# EAGLE design pololu-steppers-power-side (EAGLE 5.06)
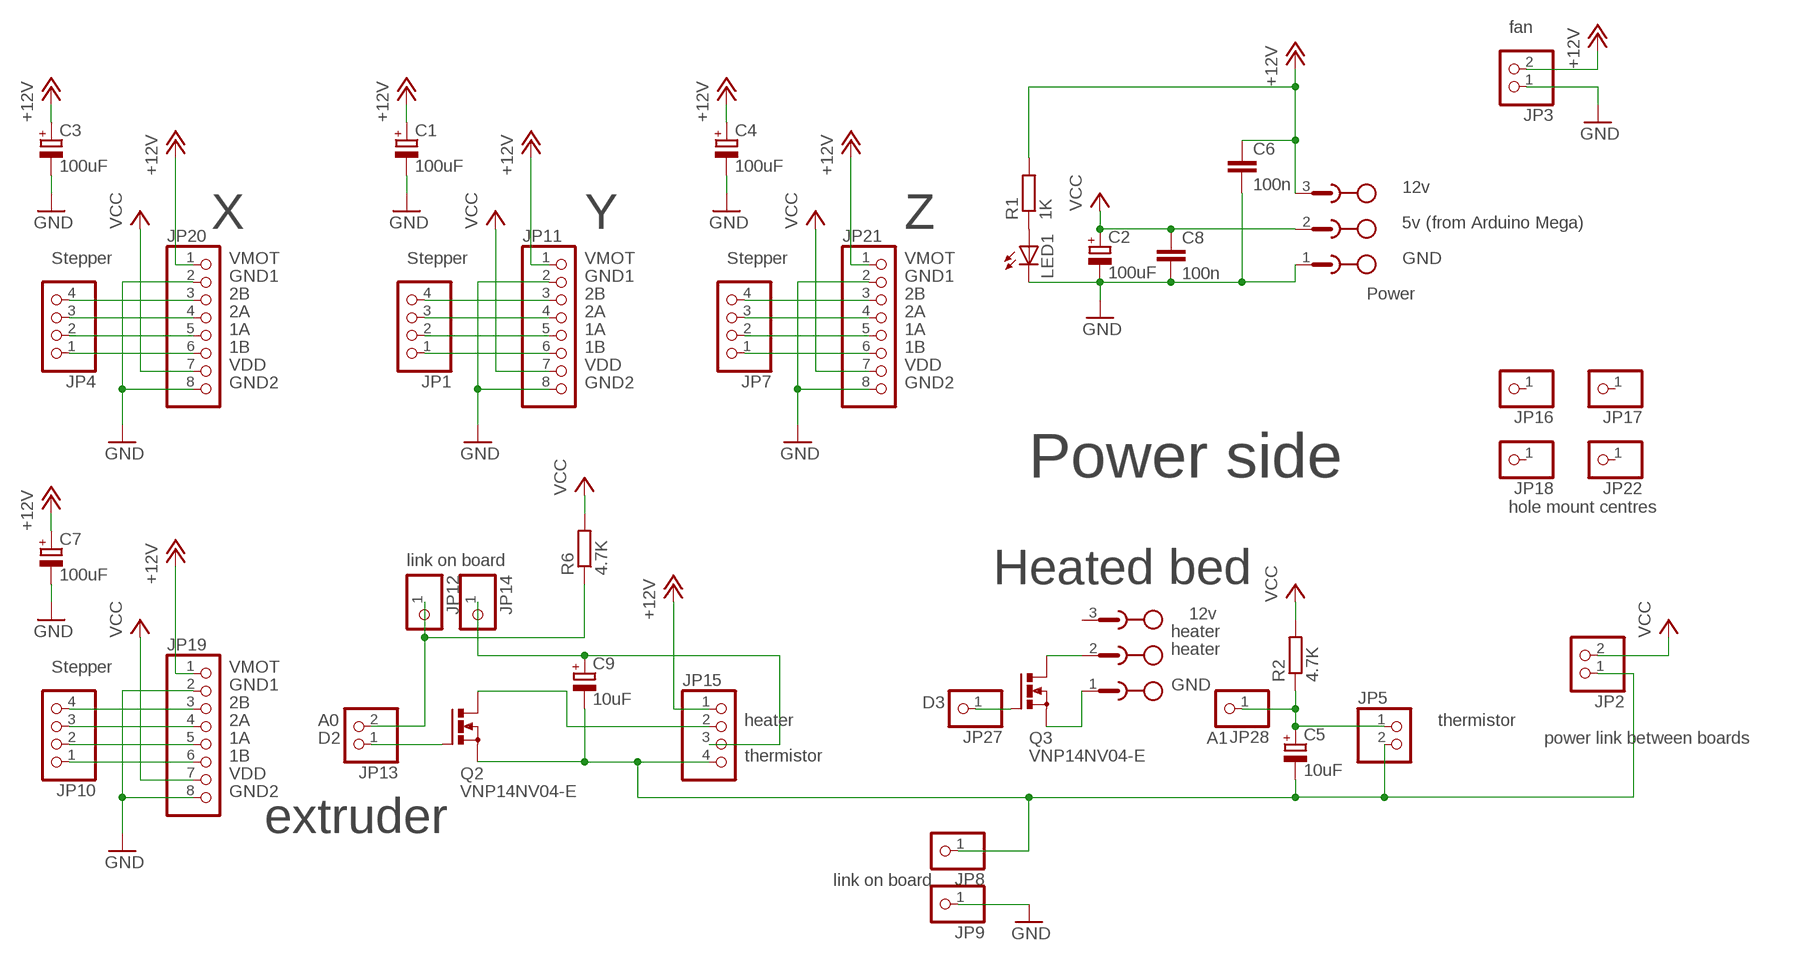
[diagram p0: schematic, sheet 1]

## Parts
C1  100uF  CPOL-EUE3.5-10  [E3,5-10]
C2  100uF  CPOL-EUE3.5-10  [E3,5-10]
C3  100uF  CPOL-EUE3.5-10  [E3,5-10]
C4  100uF  CPOL-EUE3.5-10  [E3,5-10]
C5  10uF  CPOL-EUE5-5  [E5-5]
C6  100n  C-EU025-030X050  [C025-030X050]
C7  100uF  CPOL-EUE3.5-10  [E3,5-10]
C8  100n  C-EU025-030X050  [C025-030X050]
C9  10uF  CPOL-EUE5-5  [E5-5]
JP1  PINHD-1X4  [1X04]
JP2  PINHD-1X2  [1X02]
JP3  PINHD-1X2  [1X02]
JP4  PINHD-1X4  [1X04]
JP5  PINHD-1X2  [1X02]
JP7  PINHD-1X4  [1X04]
JP8  PINHD-1X1  [1X01]
JP9  PINHD-1X1  [1X01]
JP10  PINHD-1X4  [1X04]
JP11  PINHD-1X8  [1X08]
JP12  PINHD-1X1  [1X01]
JP13  PINHD-1X2  [1X02]
JP14  PINHD-1X1  [1X01]
JP15  PINHD-1X4  [1X04]
JP16  PINHD-1X1  [1X01]
JP17  PINHD-1X1  [1X01]
JP18  PINHD-1X1  [1X01]
JP19  PINHD-1X8  [1X08]
JP20  PINHD-1X8  [1X08]
JP21  PINHD-1X8  [1X08]
JP22  PINHD-1X1  [1X01]
JP27  PINHD-1X1  [1X01]
JP28  PINHD-1X1  [1X01]
LED1  LED3MM  [LED3MM]
Q2  VNP14NV04-E  BUZ11BV  [TO220BV]
Q3  VNP14NV04-E  BUZ11BV  [TO220BV]
R1  1K  R-EU_0207/7  [0207/7]
R2  4.7K  R-EU_0207/7  [0207/7]
R6  4.7K  R-EU_0207/7  [0207/7]
X1  MSTBA3  [MSTBA3]
X2  MSTBA3  [MSTBA3]

## Nets
+12V: C1.+ C3.+ C4.+ C6.1 C7.+ JP3.2 JP11.1 JP15.1 JP19.1 JP20.1 JP21.1 R1.2 X1.3
GND: C1.- C2.- C3.- C4.- C6.2 C7.- C8.2 JP3.1 JP9.1 JP11.2 JP11.8 JP19.2 JP19.8 JP20.2 JP20.8 JP21.2 JP21.8 LED1.K(C) X1.1
N$1: C5.+ JP5.1 JP28.1 R2.1
N$2: JP12.1 JP13.2 R6.1
N$4: JP4.4 JP20.3
N$5: JP4.3 JP20.4
N$8: JP1.4 JP11.3
N$9: JP1.3 JP11.4
N$10: JP1.2 JP11.5
N$11: JP1.1 JP11.6
N$12: JP4.2 JP20.5
N$13: JP4.1 JP20.6
N$14: C5.- C9.- JP2.1 JP5.2 JP8.1 JP15.4 Q2.S
N$22: LED1.A R1.1
N$23: JP7.4 JP21.3
N$24: JP7.3 JP21.4
N$25: JP7.2 JP21.5
N$26: JP7.1 JP21.6
N$27: Q3.S X2.1
N$28: Q3.D X2.2
N$29: JP27.1 Q3.G
N$33: JP10.4 JP19.3
N$34: JP10.3 JP19.4
N$35: JP10.2 JP19.5
N$36: JP10.1 JP19.6
N$41: JP13.1 Q2.G
N$42: JP15.2 Q2.D
N$44: C9.+ JP14.1 JP15.3
VCC: C2.+ C8.1 JP2.2 JP11.7 JP19.7 JP20.7 JP21.7 R2.2 R6.2 X1.2
Unconnected: JP16.1 JP17.1 JP18.1 JP22.1 X2.3

## Notes on the sheet
- fan
- 12v
- X | Y | Z | 5v (from Arduino Mega)
- Stepper | VMOT | Stepper | VMOT | Stepper | VMOT | GND
- GND1 | GND1 | GND1
- 2B | 2B | 2B | Power
- 2A | 2A | 2A
- 1A | 1A | 1A
- 1B | 1B | 1B
- VDD | VDD | VDD
- GND2 | GND2 | GND2
- Power side
- hole mount centres
- link on board
- Heated bed
- 12v
- heater
- heater
- Stepper | VMOT
- GND1 | GND
- 2B | D3
- 2A | A0 | heater | thermistor
- 1A | D2 | A1 | power link between boards
- 1B | thermistor
- VDD
- GND2
- extruder
- link on board

## Library data of the parts
C1-C5 C7 C9 = rcl:CPOL-EU: POLARIZED CAPACITOR, European symbol
C6 C8 = rcl:C-EU: CAPACITOR, European symbol
JP1 JP4 JP7 JP10 JP15 = pinhead:PINHD-1X4: PIN HEADER
JP2 JP3 JP5 JP13 = pinhead:PINHD-1X2: PIN HEADER
JP8 JP9 JP12 JP14 JP16-JP18 JP22 JP27 JP28 = pinhead:PINHD-1X1: PIN HEADER
JP11 JP19-JP21 = pinhead:PINHD-1X8: PIN HEADER
LED1 = led:LED: LED OSRAM: - CHIPLED LG R971, LG N971, LY N971, LG Q971, LY Q971, LO R971, LY R971 LH N974, LH R974 LS Q976, LO Q976, LY Q976 LO Q996 - Hyper CHIPLED LW Q18S LB Q993, LB Q99A, LB R99A - SideLED LS A670, LO A670, LY A670, LG A670, LP A670 LB A673, LV A673, LT A673, LW A673 LH A674 LY A675 LS A676, LA A676, LO A676, LY A676, LW A676 LS A679, LY A679, LG A679 - Hyper Micro SIDELED® LS Y876, LA Y876, LO Y876, LY Y876 LT Y87S - SmartLED LW L88C, LW L88S LB L89C, LB L89S, LG L890 LS L89K, LO L89K, LY L89K LS L896, LA L896, LO L896, LY L896 - TOPLED LS T670, LO T670, LY T670, LG T670, LP T670 LSG T670, LSP T670, LSY T670, LOP T670, LYG T670 LG T671, LOG T671, LSG T671 LB T673, LV T673, LT T673, LW T673 LH T674 LS T676, LA T676, LO T676, LY T676, LB T676, LH T676, LSB T676, LW T676 LB T67C, LV T67C, LT T67C, LS T67K, LO T67K, LY T67K, LW E67C LS E67B, LA E67B, LO E67B, LY E67B, LB E67C, LV E67C, LT E67C LW T67C LS T679, LY T679, LG T679 LS T770, LO T770, LY T770, LG T770, LP T770 LB T773, LV T773, LT T773, LW T773 LH T774 LS E675, LA E675, LY E675, LS T675 LS T776, LA T776, LO T776, LY T776, LB T776 LHGB T686 LT T68C, LB T68C - Hyper Mini TOPLED® LB M676 - Mini TOPLED Santana® LG M470 LS M47K, LO M47K, LY M47K Source: http://www.osram.convergy.de LUXEON: - LUMILED® LXK2-PW12-R00, LXK2-PW12-S00, LXK2-PW14-U00, LXK2-PW14-V00 LXK2-PM12-R00, LXK2-PM12-S00, LXK2-PM14-U00 LXK2-PE12-Q00, LXK2-PE12-R00, LXK2-PE12-S00, LXK2-PE14-T00, LXK2-PE14-U00 LXK2-PB12-K00, LXK2-PB12-L00, LXK2-PB12-M00, LXK2-PB14-N00, LXK2-PB14-P00, LXK2-PB14-Q00 LXK2-PR12-L00, LXK2-PR12-M00, LXK2-PR14-Q00, LXK2-PR14-R00 LXK2-PD12-Q00, LXK2-PD12-R00, LXK2-PD12-S00 LXK2-PH12-R00, LXK2-PH12-S00 LXK2-PL12-P00, LXK2-PL12-Q00, LXK2-PL12-R00 Source: www.luxeon.com KINGBRIGHT: KA-3528ASYC Source: www.kingbright.com
Q2 Q3 = transistor-power:BUZ11: N-CHANNEL MOS FET
R1 R2 R6 = rcl:R-EU_: RESISTOR, European symbol
X1 X2 = con-phoenix-508:MSTBA3: PHOENIX

## Board
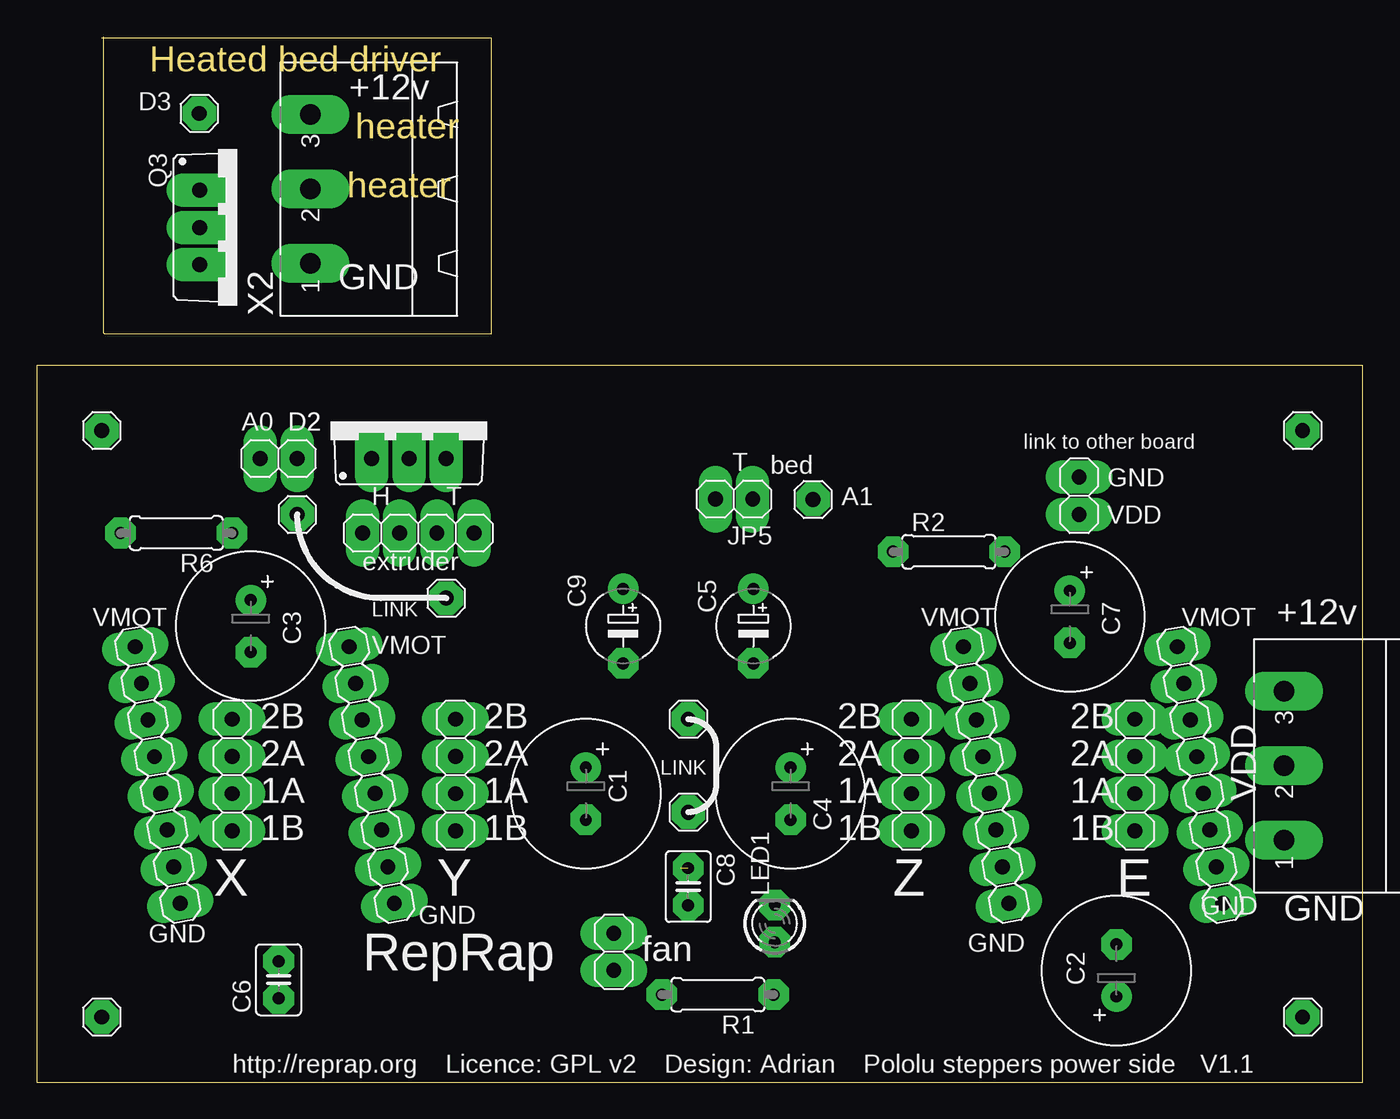
[diagram p1: board, top side]
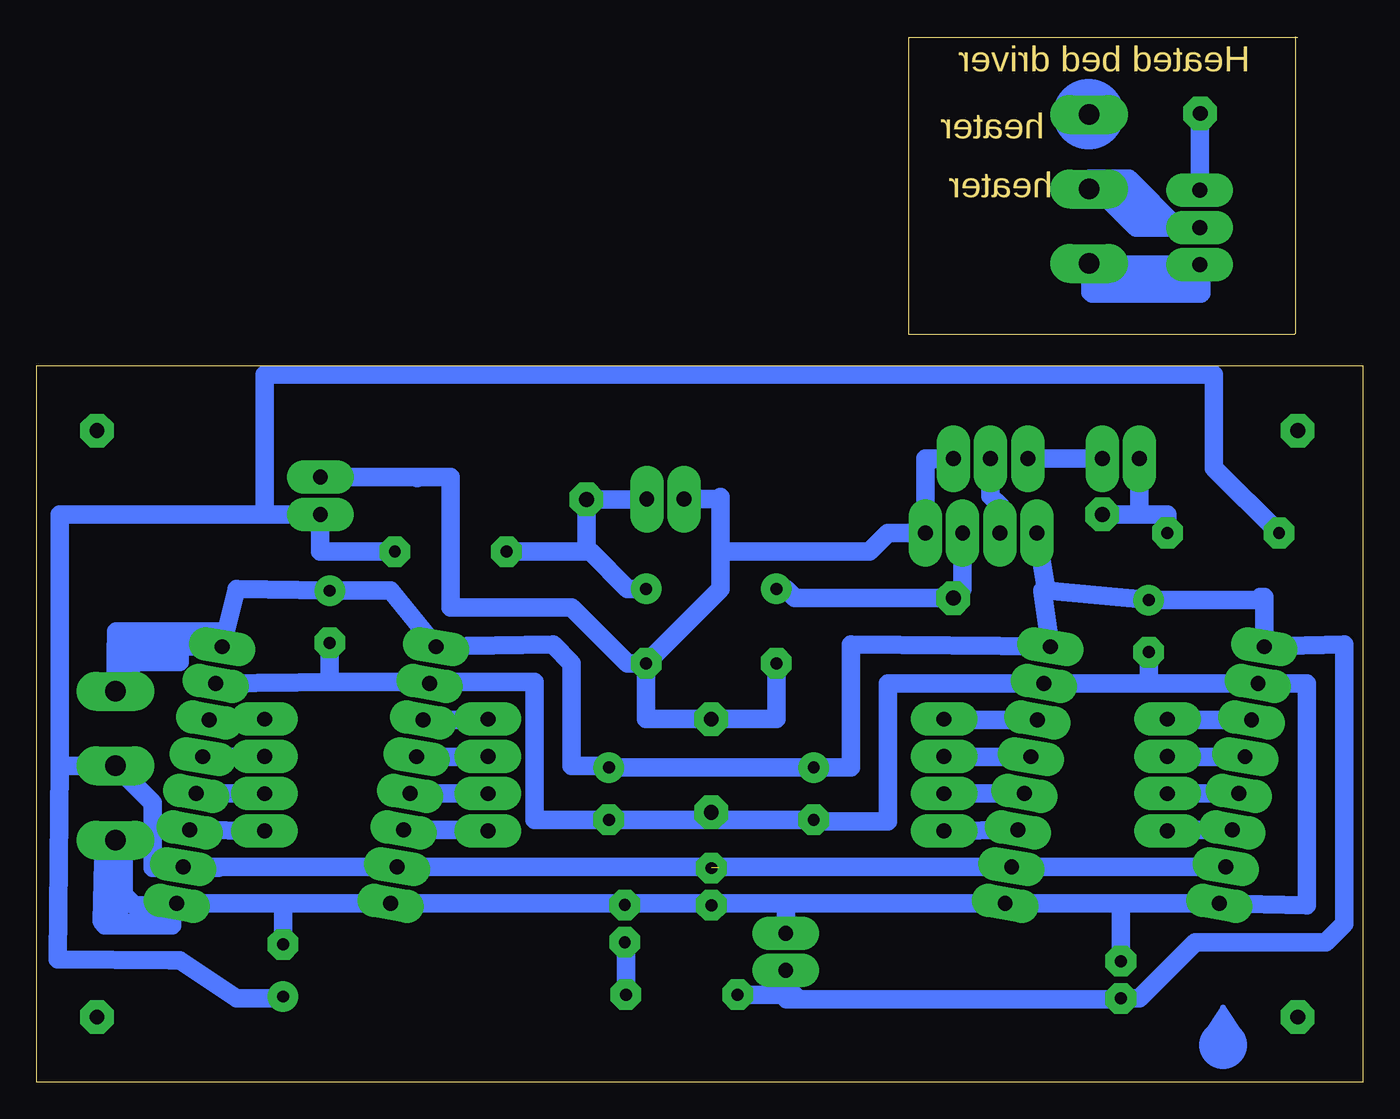
[diagram p2: board, bottom side, seen from below]

Size 90.47 x 71.33 mm. Coordinates in mm from the lower left corner, seen from the top.
Outline: 4.43,71.26 31,71.26 31,51.04 4.64,51.04 4.57,51.11 4.57,71.33
Outline: 0,0 90.47,0 90.47,48.88 0,48.88 0,0
Copper layers (1*16): Top 0.035mm / dielectric 1.5mm / Bottom 0.035mm
Design rules "default *": minimum track width 10mil, minimum drill 24mil, track to track 8mil, track to pad 8mil, pad to pad 8mil, via to via 8mil, smd to smd 8mil, copper to edge 40mil, drill to drill 8mil, minimum pad ring 25mil, minimum via ring 8mil, stop-mask expansion 4mil, vias tented up to drill 0mil, thermal gap 10mil

### Footprints (pad centres in the part's own frame; a part is rotated, then mirrored left to right if it is on the bottom)
E3,5-10 = drill 0.813 pad 1.6 round: + -1.778,0 | drill 0.813 pad 1.6 octagon: - 1.778,0
E5-5 = drill 0.813 pad 1.905 round: + -2.54,0 | drill 0.813 pad 1.905 octagon: - 2.54,0
C025-030X050 = drill 0.813 octagon: 1 -1.27,0; 2 1.27,0
1X04 = drill 1.016 long: 1 -3.81,0; 2 -1.27,0; 3 1.27,0; 4 3.81,0
1X02 = drill 1.016 long: 1 -1.27,0; 2 1.27,0
1X01 = drill 1.016 octagon: 1 0,0
1X08 = drill 1.016 long: 1 -8.89,0; 2 -6.35,0; 3 -3.81,0; 4 -1.27,0; 5 1.27,0; 6 3.81,0; 7 6.35,0; 8 8.89,0
LED3MM = drill 0.813 octagon: A -1.27,0; K 1.27,0
TO220BV = drill 1.016 long: D 0,-2.54; G -2.54,-2.54; S 2.54,-2.54
0207/7 = drill 0.813 octagon: 1 -3.81,0; 2 3.81,0
MSTBA3 = drill 1.397 long: 1 -5.08,5.08; 2 0,5.08; 3 5.08,5.08

### Placement (x,y rotation side)
C1  37.47,19.68 270 top
C2  73.66,7.62 90 top
C3  14.61,31.11 270 top
C4  51.44,19.68 270 top
C5  48.9,31.11 270 top
C6  16.51,6.99 90 top
C7  70.48,31.75 270 top
C8  44.45,13.34 270 top
C9  40.01,31.11 270 top
JP1  28.57,20.95 90 top
JP2  71.12,40.01 270 top
JP3  39.37,8.89 270 top
JP4  13.34,20.95 90 top
JP5  47.58,39.78 180 top
JP7  59.69,20.95 90 top
JP8  44.45,24.77 0 top
JP9  44.45,18.41 0 top
JP10  74.93,20.95 90 top
JP11  22.86,20.95 280 top
JP12  17.78,38.73 0 top
JP13  16.51,42.55 180 top
JP14  27.94,33.02 0 top
JP15  26.04,37.47 0 top
JP16  4.45,44.45 0 top
JP17  4.45,4.45 0 top
JP18  86.36,44.45 0 top
JP19  79.38,20.95 280 top
JP20  8.26,20.95 280 top
JP21  64.77,20.95 280 top
JP22  86.36,4.45 0 top
JP27  11.1,66.09 0 top
JP28  52.97,39.75 0 top
LED1  50.35,10.82 90 top
Q2  25.4,45.09 0 top
Q3  13.66,58.31 270 top
R1  46.47,5.97 180 top
R2  62.23,36.2 0 top
R6  9.53,37.47 180 top
X1  90.17,21.59 90 top
X2  23.74,60.93 90 top

### Tracks (layer width: path | path; a pad name or v marks a point on that pad's centre or on a via)
+12V
  Bottom 1.27: 21.59,33.53 C3.+ 7,32.89 7,33.1 6.71,33.1 JP20.1 1.27,29.84 1.27,10.79 2.54,9.53 11.43,9.53 15.24,5.71 C6.1 16.51,5.66 38.79,5.66 | 21.59,33.53 21.86,33.53 JP11.1 34.92,29.84 34.92,21.46 C1.+ C4.+ 52.07,21.59 53.98,21.59 53.98,28.57 55.24,29.84 JP21.1 66.31,33.53 C7.+ 76.83,33.66 JP19.1 85.06,29.71 85.06,29.82 85.09,29.82 X1.3 | 21.59,33.53 JP15.1 | JP3.2 39.32,7.62 39.32,5.66 38.79,5.66 | R1.2 38.79,5.97 38.79,5.66
GND
  Bottom 1.27: 39.37,12.2 JP11.8 16.51,12.2 | 39.37,12.2 44.45,12.2 | 44.45,12.2 50.62,12.2 | 50.62,12.2 JP21.8 73.66,12.2 | 16.51,12.2 JP20.8 3.81,12.06 3.81,27.21 JP20.2 14.61,27.21 | 14.61,27.21 JP11.2 32.38,27.21 32.38,17.78 36.83,17.78 C1.- 44.45,17.91 | 44.45,17.91 C4.- 56.52,17.91 56.52,27.3 65.87,27.3 | 65.87,27.3 JP21.2 | 65.87,27.3 69.85,27.3 | 69.85,27.3 70.48,27.3 C7.- | 14.61,27.21 C3.- | 39.37,12.2 JP3.1 | 44.45,17.91 JP9.1 | 73.66,12.2 JP19.8 82.42,12.2 82.55,12.06 83.82,12.06 84.48,12.73 | 73.66,12.2 C2.- | 44.45,12.2 C8.2 | 16.51,12.2 C6.2 | 84.48,12.73 85.09,13.34 X1.1 | 69.85,27.3 JP19.2 | 84.48,12.73 85.88,11.34 | LED1.K 50.62,12.09 50.62,12.2
N$1
  Bottom 1.27: 52.97,36.2 52.7,36.2 50.16,33.66 C5.+ | 52.97,36.2 R2.1 | 52.97,36.2 JP28.1 48.85,39.75 JP5.1
N$2
  Bottom 1.27: 15.24,38.73 JP12.1 | 15.24,38.73 JP13.2 | 15.24,38.73 13.34,38.73 R6.1
N$3
  Bottom 1.27: 84.06,26.61 85.06,26.61 | 84.06,26.61 84.06,26.54 | 84.06,26.61 84.06,28.68 80.7,28.68 80.7,30.74 | 77.8,30.74 80.7,30.74 | 80.7,30.74 85.06,30.74 85.06,29.67
N$4
  Bottom 1.27: JP20.3 13.28,24.71 JP4.4
N$5
  Bottom 1.27: JP20.4 13.32,22.21 JP4.3
N$6
  Bottom 0.406: 9.53,4.61 9.53,4.36 9.83,4.06 9.45,4.06 9.3,4.21 9.3,4.01 8.82,3.53 9.52,3.53 9.74,3.75 9.74,2.94 9.66,2.86 9.66,2.18 9.62,2.14 9.52,2.14 9.1,2.55
N$7
  Bottom 0.406: 8.26,3.17 9.53,5.08 10.79,3.17
N$8
  Bottom 1.27: JP11.3 28.52,24.71 JP1.4
N$9
  Bottom 1.27: JP11.4 28.56,22.21 JP1.3
N$10
  Bottom 1.27: 22.84,19.7 JP11.5 JP1.2
N$11
  Bottom 1.27: JP11.6 JP1.1
N$12
  Bottom 1.27: JP20.5 13.32,19.7 JP4.2
N$13
  Bottom 1.27: JP20.6 13.28,17.2 JP4.1
N$14
  Bottom 1.27: 71.75,41.27 JP2.1 64.59,41.27 | C9.- 40.01,24.77 JP8.1 48.9,24.77 C5.- | 64.59,41.27 62.23,41.27 62.23,32.38 53.98,32.38 50.16,28.57 C5.- | 43.81,35.68 43.81,33.66 C5.- | 43.81,35.68 43.81,36.2 33.66,36.2 32.38,37.47 JP15.4 29.84,42.55 29.32,42.55 | 29.32,42.55 Q2.S | 29.32,42.55 29.32,42.48 | 64.59,41.27 64.52,41.2 | JP5.2 43.81,39.78 43.81,39.94 43.81,35.68
N$15
  Bottom 0.406: 9.31,1.99 9.31,3.98 9.7,4.36 9.54,4.36 9.47,4.43
N$17
  Bottom 1.27: 86.05,11.01 85.9,16.44 85.13,16.36 84.52,16.36 84.52,12.08 85.82,11.01
N$19
  Bottom 1.27: 18.66,61.63 15.97,61.63 12.64,58.3 11.37,58.3 11.73,58.66 13.59,58.66 13.95,58.3 15.45,58.3 17.39,60.24 18.66,60.24
N$21
  Bottom 1.27: 85.97,10.86 81.31,10.94 81.24,11.93 81.24,10.71 85.82,10.71
N$22
  Bottom 1.27: LED1.A 50.28,9.55 R1.1
N$23
  Bottom 1.27: JP21.3 59.75,24.71 JP7.4
N$24
  Bottom 1.27: JP21.4 59.71,22.21 JP7.3
N$25
  Bottom 1.27: JP21.5 59.71,19.7 JP7.2
N$26
  Bottom 1.27: JP21.6 59.75,17.2 JP7.1
N$27
  Bottom 1.27: Q3.S 18.58,55.77 X2.1
N$28
  Bottom 1.27: Q3.D 13.84,58.31 16.32,60.8 18.53,60.8 X2.2
N$29
  Bottom 1.27: JP27.1 11.12,66.09 Q3.G
N$30
  Bottom 1.27: 10.98,55.37 11.73,54.62 17.55,54.62 18.46,55.53 18.54,55.53 18.58,55.49 18.58,53.9 18.46,53.78 11.05,53.78 11.02,53.82 11.02,55.65
N$33
  Bottom 1.27: JP10.4 JP19.3 78.71,24.77
N$34
  Bottom 1.27: JP10.3 JP19.4 79.58,22.23
N$35
  Bottom 1.27: JP10.2 JP19.5
N$36
  Bottom 1.27: JP10.1 JP19.6
N$41
  Bottom 1.27: JP13.1 Q2.G
N$42
  Bottom 1.27: 24.77,36.83 JP15.2 24.77,39.37 25.4,40.01 Q2.D
N$44
  Bottom 1.27: JP15.3 27.3,33.66 JP14.1 38.73,33.02 39.37,33.66 C9.+
VCC  (1 unrouted)
  Bottom 1.27: JP20.7 JP11.7 43.81,14.7 | 43.81,14.7 JP21.7 | JP21.7 JP19.7 | 74.93,38.73 88.9,38.73 88.9,21.59 | 74.93,38.73 JP2.2 71.12,36.2 R2.2 | JP21.7 78.11,14.7 78.11,14.61 82.55,14.61 82.55,19.05 X1.2 88.9,21.59 | 74.93,38.73 74.93,48.26 10.16,48.26 10.16,41.91 R6.2 | 88.9,21.59 89.05,8.36 81.35,8.3 80.72,8.3 76.83,5.71 73.66,5.71 C2.+ | 43.81,14.7 43.91,14.61
(copper drawn outside any net)
  shapes: Bottom circle x6

### Text on the board
Dimension: Heated bed driver | heater | heater
tPlace: +12v | D3 | GND | A0 | D2 | D2 | link to other board | T | bed | GND | H | T | A1 | VDD | extruder | LINK | VMOT | VMOT | VMOT | +12v | VMOT | 2B | 2B | 2B | 2B | 2A | 2A | 2A | 2A | LINK | 1A | 1A | 1A | 1A | VDD | 1B | 1B | 1B | 1B | X | Y | Z | E | GND | GND | GND | GND | GND | RepRap | http://reprap.org Licence: GPL v2 Design: Adrian Pololu steppers power side | V1.1
tNames: fan